# EAGLE design pcb (EAGLE 7.5.0)
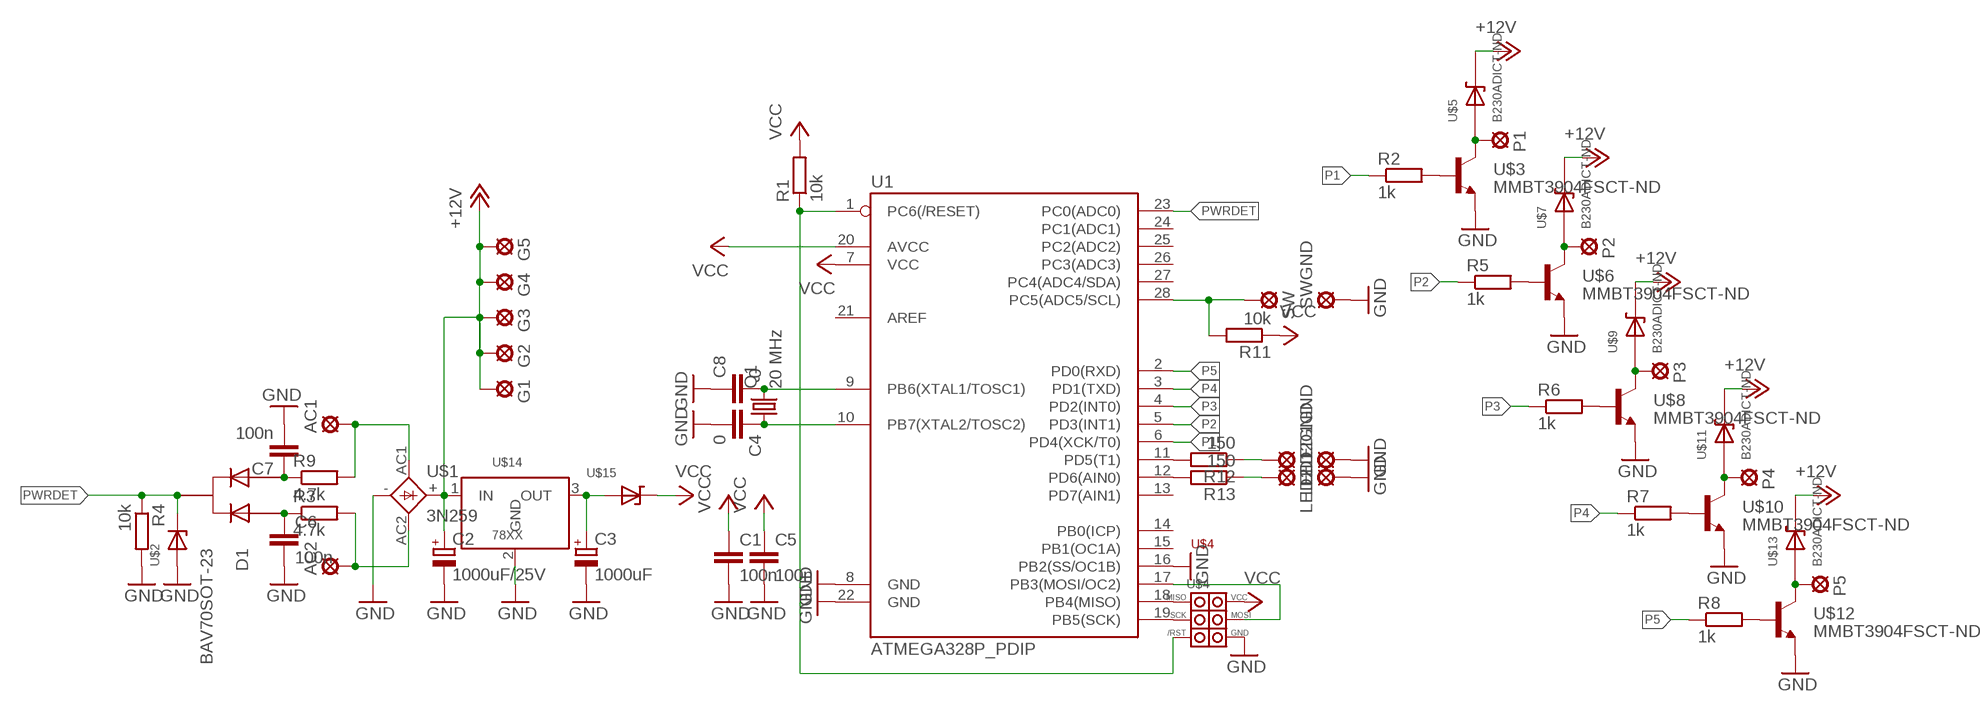
[diagram p0: schematic, sheet 1]

## Parts
AC1  LSP10  [LSP10]
AC2  LSP10  [LSP10]
C1  100n  C-EUC0603  [C0603]
C2  1000uF/25V  CPOL-EUE5-13  [E5-13]
C3  1000uF  CPOL-EUE5-10.5  [E5-10,5]
C4  0  C-EUC0603  [C0603]
C5  100n  C-EUC0603  [C0603]
C6  100n  C-EUC0603  [C0603]
C7  100n  C-EUC0603  [C0603]
C8  0  C-EUC0603  [C0603]
D1  BAV70SOT-23  [SOT23]
G1  LSP10  [LSP10]
G2  LSP10  [LSP10]
G3  LSP10  [LSP10]
G4  LSP10  [LSP10]
G5  LSP10  [LSP10]
LED1  LSP10  [LSP10]
LED1GND  LSP10  [LSP10]
LED2  LSP10  [LSP10]
LED2GND  LSP10  [LSP10]
P1  LSP10  [LSP10]
P2  LSP10  [LSP10]
P3  LSP10  [LSP10]
P4  LSP10  [LSP10]
P5  LSP10  [LSP10]
Q1  20 MHz  CRYSTALCTS406CTS406  [CTS406]
R1  10k  R-EU_R0603  [R0603]
R2  1k  R-EU_R0603  [R0603]
R3  4.7k  R-EU_R0603  [R0603]
R4  10k  R-EU_R0603  [R0603]
R5  1k  R-EU_R0603  [R0603]
R6  1k  R-EU_R0603  [R0603]
R7  1k  R-EU_R0603  [R0603]
R8  1k  R-EU_R0603  [R0603]
R9  4.7k  R-EU_R0603  [R0603]
R11  10k  R-EU_R0603  [R0603]
R12  150  R-EU_R0603  [R0603]
R13  150  R-EU_R0603  [R0603]
SW  LSP10  [LSP10]
SWGND  LSP10  [LSP10]
U1  ATMEGA328P_PDIP  [DIL28-3]
U$1  3N259  [KBPM]
U$2  MA8051CT  [SOD323-W]
U$3  MMBT3904FSCT-ND  [SOT-23]
U$4  ISP-HEADER-6  [ISPHEADER-6]
U$5  B230ADICT-ND  [SMA/SMB]
U$6  MMBT3904FSCT-ND  [SOT-23]
U$7  B230ADICT-ND  [SMA/SMB]
U$8  MMBT3904FSCT-ND  [SOT-23]
U$9  B230ADICT-ND  [SMA/SMB]
U$10  MMBT3904FSCT-ND  [SOT-23]
U$11  B230ADICT-ND  [SMA/SMB]
U$12  MMBT3904FSCT-ND  [SOT-23]
U$13  B230ADICT-ND  [SMA/SMB]
U$14  78XX  [DPAK]
U$15  MBRM140T1  [CASE457]

## Nets
+12V: C2.+ G1.MP G2.MP G3.MP G4.MP G5.MP U$1.+ U$5.1(CAT) U$7.1(CAT) U$9.1(CAT) U$11.1(CAT) U$13.1(CAT) U$14.1(IN)
/RST: R1.1 U1.1(PC6(/RESET)) U$4./RST
AC1: AC1.MP R9.2 U$1.AC1
AC2: AC2.MP R3.2 U$1.AC2
LED1: LED1.MP R12.1
LED2: LED2.MP R13.1
MISO: U1.18(PB4(MISO)) U$4.MISO
MOSI: U1.17(PB3(MOSI/OC2)) U$4.MOSI
N$1: C8.2 Q1.3 U1.9(PB6(XTAL1/TOSC1))
N$2: C6.1 D1.1ANODE(ANODE1) R3.1
N$3: C4.1 Q1.1 U1.10(PB7(XTAL2/TOSC2))
N$4: C3.+ U$14.3(OUT) U$15.2(AN)
N$5: P3.MP U$8.3(C) U$9.2(AN)
N$6: P2.MP U$6.3(C) U$7.2(AN)
N$7: R5.2 U$6.1(B)
N$8: C7.1 D1.2ANODE(ANODE2) R9.1
N$9: P5.MP U$12.3(C) U$13.2(AN)
N$17: R11.2 SW.MP U1.28(PC5(ADC5/SCL))
N$18: R12.2 U1.11(PD5(T1))
N$19: R2.2 U$3.1(B)
N$20: P1.MP U$3.3(C) U$5.2(AN)
N$21: P4.MP U$10.3(C) U$11.2(AN)
N$22: R6.2 U$8.1(B)
N$23: R13.2 U1.12(PD6(AIN0))
N$24: R7.2 U$10.1(B)
N$25: R8.2 U$12.1(B)
N$34: C1.2 C2.- C3.- C4.2 C5.2 C6.2 C7.2 C8.1 LED1GND.MP LED2GND.MP R4.2 SWGND.MP U1.8(GND) U1.16(PB2(SS/OC1B)) U1.22(GND) U$1.- U$2.A(AN) U$3.2(E) U$4.GND U$6.2(E) U$8.2(E) U$10.2(E) U$12.2(E) U$14.2(GND) ; supply symbol labelled GND
P1: R2.1 U1.6(PD4(XCK/T0))
P2: R5.1 U1.5(PD3(INT1))
P3: R6.1 U1.4(PD2(INT0))
P4: R7.1 U1.3(PD1(TXD))
P5: R8.1 U1.2(PD0(RXD))
PWRDET: D1.3CATODE(CATODE) R4.1 U1.23(PC0(ADC0)) U$2.C(CAT)
SCK: U1.19(PB5(SCK)) U$4.SCK
VCC: C1.1 C5.1 R1.2 R11.1 U1.7(VCC) U1.20(AVCC) U$4.VCC U$15.1(CAT)
Unconnected: U1.13(PD7(AIN1)) U1.14(PB0(ICP)) U1.15(PB1(OC1A)) U1.21(AREF) U1.24(PC1(ADC1)) U1.25(PC2(ADC2)) U1.26(PC3(ADC3)) U1.27(PC4(ADC4/SDA))

## Library data of the parts
AC1 AC2 G1-G5 LED1 LED1GND LED2 LED2GND P1-P5 SW SWGND = solpad:LSP10: SOLDER PAD drill 1.0 mm, distributor Buerklin, 12H555
C1 C4-C8 = rcl:C-EU: CAPACITOR, European symbol
C2 C3 = mrrcomps:CPOL-EU: POLARIZED CAPACITOR, European symbol
D1 = BAV70:BAV70: Small Signal Diode BAV70
Q1 = mrrcomps:CRYSTALCTS406: CRYSTAL
R1-R9 R11-R13 = rcl:R-EU_: RESISTOR, European symbol
U1 = mrrcomps:ATMEGA328P_PDIP: uC used in the Arduino 32kb flash, 1k EEPROM, 2k SRAM This is the through-hole version of this chip.
U$1 = BAV70:3N259
U$2 = mrrcomps:MA8051CT
U$3 U$6 U$8 U$10 U$12 = GuShH:MMBT3904
U$4 = Lars-Wafer-Connectors:ISP-HEADER-6
U$5 U$7 U$9 U$11 U$13 = mrrcomps:B230ADICT-ND
U$14 = car:78XX
U$15 = mrrcomps:MBRM140T1: SMT Schottky Power Rectifier

## Board
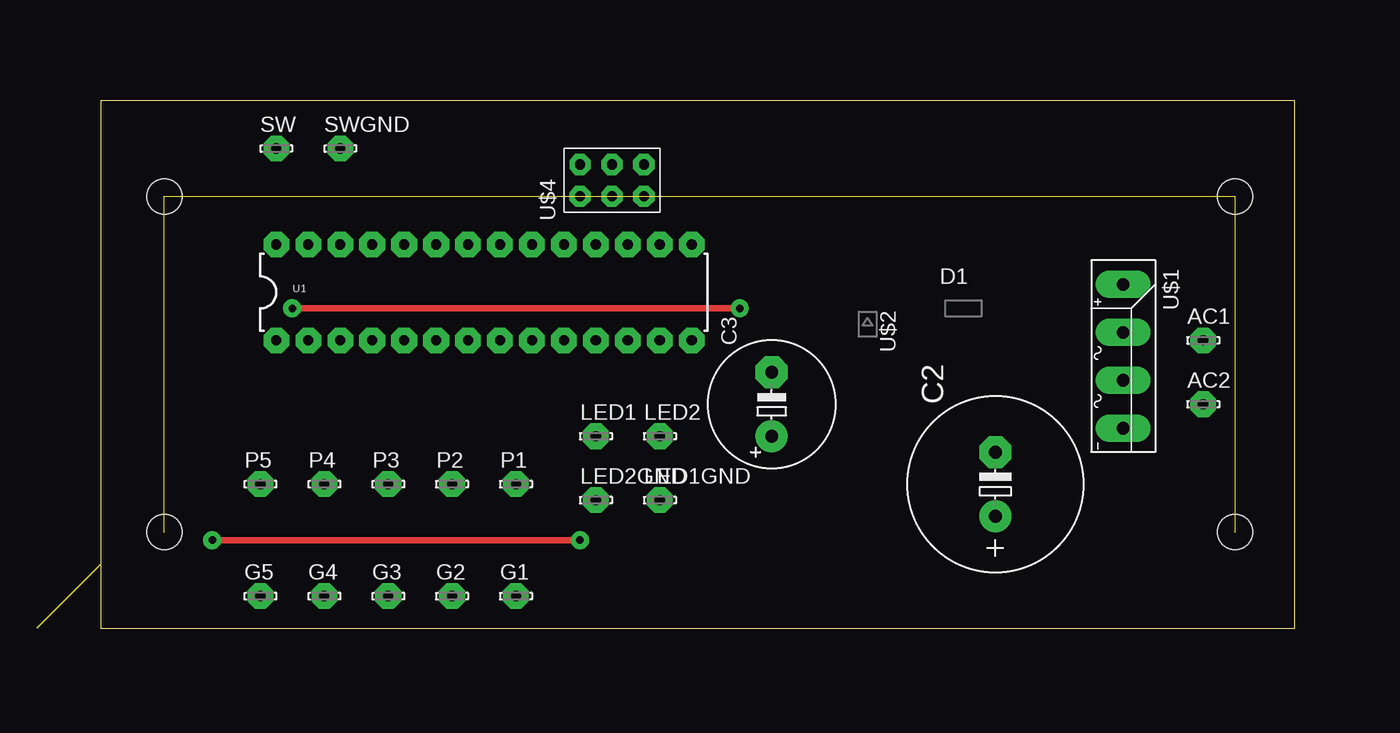
[diagram p1: board, top side]
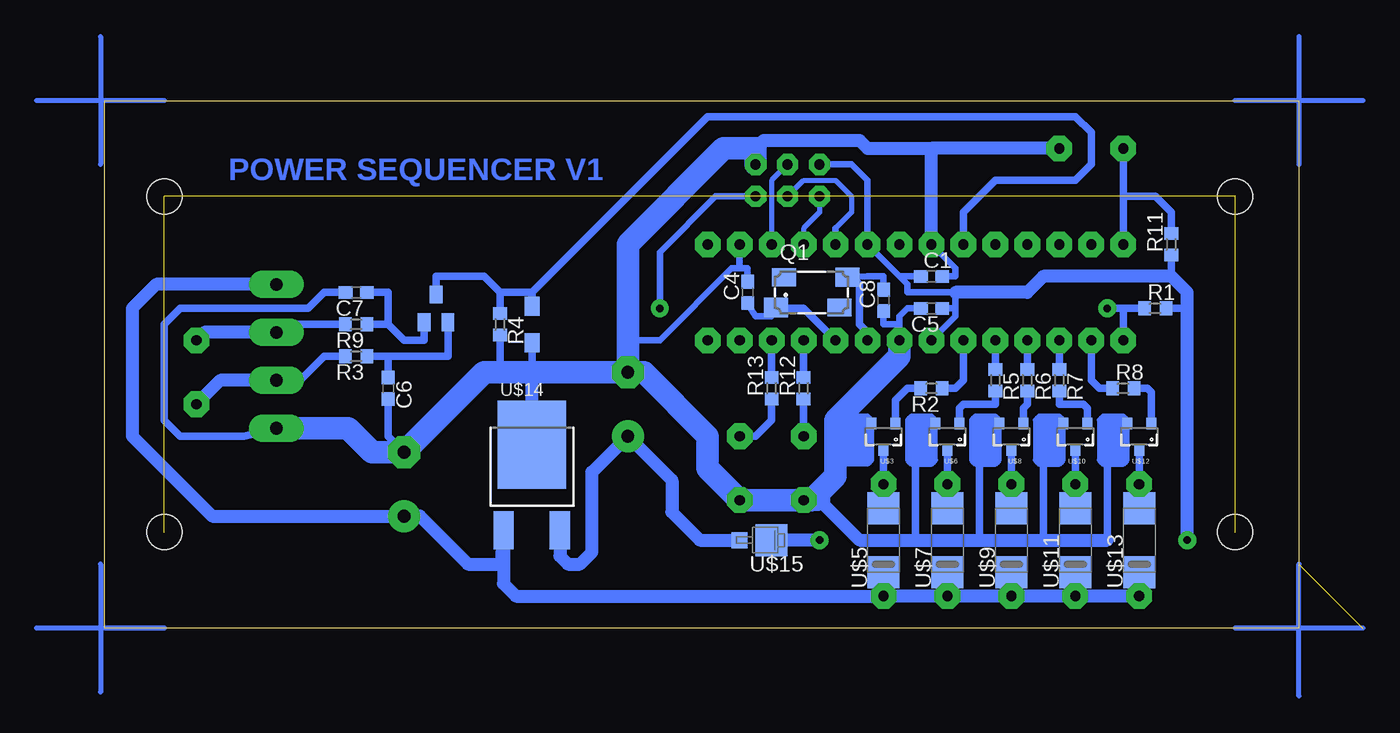
[diagram p2: board, bottom side, seen from below]

Size 94.92 x 41.9 mm. Coordinates in mm from the lower left corner, seen from the top.
Outline: 94.92,0 94.92,41.9 0,41.9 0,0 94.92,0
Copper layers (1*16): Top 0.035mm / dielectric 1.5mm / Bottom 0.035mm
Design rules "default": minimum track width 10mil, minimum drill 24mil, track to track 8mil, track to pad 8mil, pad to pad 8mil, via to via 8mil, smd to smd 8mil, copper to edge 40mil, drill to drill 8mil, minimum pad ring 10mil, minimum via ring 8mil, stop-mask expansion 4mil, vias tented up to drill 0mil, thermal gap 10mil
Holes 2.8 mm at 90.17,34.29 90.17,7.62 5.08,34.29 5.08,7.62

### Footprints (pad centres in the part's own frame; a part is rotated, then mirrored left to right if it is on the bottom)
LSP10 = drill 0.813 pad 2.032 octagon: MP 0,0
C0603 = smd 1.1 x 1: 1 -0.85,0; 2 0.85,0
E5-13 = drill 1.016 pad 2.54: + -2.54,0 | drill 1.016 pad 2.54 octagon: - 2.54,0
E5-10,5 = drill 1.016 pad 2.54: + -2.54,0 | drill 1.016 pad 2.54 octagon: - 2.54,0
SOT23 = smd 1 x 1.4 bottom: 1ANODE -0.95,-1.1; 2ANODE 0.95,-1.1; 3CATODE 0,1.1
CTS406 = smd 1.9 x 1.524: 1 -2.835,-1.2; 3 2.835,1.2 | smd 1.9 x 1.4: 2 2.2,-1.2; 4 -2.2,1.2
R0603 = smd 1 x 1.1: 1 -0.85,0; 2 0.85,0
DIL28-3 = drill 0.813 pad 2.032 octagon: 1 -16.51,-3.81; 2 -13.97,-3.81; 3 -11.43,-3.81; 4 -8.89,-3.81; 5 -6.35,-3.81; 6 -3.81,-3.81; 7 -1.27,-3.81; 8 1.27,-3.81; 9 3.81,-3.81; 10 6.35,-3.81; 11 8.89,-3.81; 12 11.43,-3.81; 13 13.97,-3.81; 14 16.51,-3.81; 15 16.51,3.81; 16 13.97,3.81; 17 11.43,3.81; 18 8.89,3.81; 19 6.35,3.81; 20 3.81,3.81; 21 1.27,3.81; 22 -1.27,3.81; 23 -3.81,3.81; 24 -6.35,3.81; 25 -8.89,3.81; 26 -11.43,3.81; 27 -13.97,3.81; 28 -16.51,3.81
KBPM = drill 1 pad 2.184 long: + -5.715,0; - 5.715,0; AC1 -1.905,0; AC2 1.905,0
SOD323-W = smd 1.5 x 1.2 bottom: A 1.45,0; C -1.45,0
SOT-23 = smd 0.8 x 0.9: 1 -0.95,-1; 2 0.95,-1; 3 0,1.1
ISPHEADER-6 = drill 0.8 pad 1.676 octagon: /RST -1.27,-2.54; GND 1.27,-2.54; MISO -1.27,2.54; MOSI 1.27,0; SCK -1.27,0; VCC 1.27,2.54
SMA/SMB = smd 2.54 x 2.54: 1 -2.54,0; 2 2.54,0
DPAK = smd 1.6 x 2.997: 1 -2.261,-4.928; 3 2.21,-4.928 | smd 5.452 x 7: 2 0,1.853
CASE457 = smd 2.54 x 2.54: 1 -1.27,0 | smd 1.27 x 1.27: 2 1.27,0

### Placement (x,y rotation side)
AC1  87.63,22.86 0 top
AC2  87.63,17.78 0 top
C1  29.21,27.94 0 bottom
C2  71.12,11.43 90 top
C3  53.34,17.78 90 top
C4  43.81,26.67 90 bottom
C5  29.21,25.4 180 bottom
C6  72.39,19.05 270 bottom
C7  74.93,26.67 180 bottom
C8  33.02,26.04 90 bottom
D1  68.58,25.4 0 top
G1  33.02,2.54 0 top
G2  27.94,2.54 0 top
G3  22.86,2.54 0 top
G4  17.78,2.54 0 top
G5  12.7,2.54 0 top
LED1  39.37,15.24 0 top
LED1GND  44.45,10.16 0 top
LED2  44.45,15.24 0 top
LED2GND  39.37,10.16 0 top
P1  33.02,11.43 0 top
P2  27.94,11.43 0 top
P3  22.86,11.43 0 top
P4  17.78,11.43 0 top
P5  12.7,11.43 0 top
Q1  38.73,26.67 0 bottom
R1  11.43,25.4 0 bottom
R2  29.21,19.05 180 bottom
R3  74.93,21.59 180 bottom
R4  63.5,24.13 270 bottom
R5  24.13,19.68 270 bottom
R6  21.59,19.68 270 bottom
R7  19.05,19.68 270 bottom
R8  13.97,19.05 0 bottom
R9  74.93,24.13 180 bottom
R11  10.16,30.48 90 bottom
R12  39.37,19.05 90 bottom
R13  41.91,19.05 90 bottom
SW  13.97,38.1 0 top
SWGND  19.05,38.1 0 top
U1  30.48,26.67 0 top
U$1  81.28,21.59 270 top
U$2  60.96,24.13 270 top
U$3  33.02,15.24 180 bottom
U$4  40.64,35.56 90 top
U$5  33.02,6.99 90 bottom
U$6  27.94,15.24 180 bottom
U$7  27.94,6.99 90 bottom
U$8  22.86,15.24 180 bottom
U$9  22.86,6.99 90 bottom
U$10  17.78,15.24 180 bottom
U$11  17.78,6.99 90 bottom
U$12  12.7,15.24 180 bottom
U$13  12.7,6.99 90 bottom
U$14  60.96,12.7 0 bottom
U$15  43.18,6.99 180 bottom

### Tracks (layer width: path | path; a pad name or v marks a point on that pad's centre or on a via)
+12V
  Bottom 0.61: U$13.1 G5.MP | U$11.1 G4.MP | U$9.1 G3.MP | U$7.1 G2.MP | U$5.1 G1.MP
  Bottom 1.016: U$1.+ 90.81,27.3 92.71,25.4 92.71,15.24 86.36,8.89 C2.+ 69.85,8.89 66.04,5.08 63.37,5.08 U$14.1 63.22,3.53 62.23,2.54 G1.MP G2.MP G3.MP G4.MP G5.MP
/RST  (via drill 0.6 pad 1.42)
  Top 0.508: v15.24,25.4 v50.8,25.4
  Bottom 0.508: v50.8,25.4 50.8,29.84 46.35,34.29 U$4./RST
  Bottom 0.61: R1.1 v15.24,25.4 13.97,25.4 U1.1
AC1
  Bottom 0.61: 87,23.5 AC1.MP | U$1.AC1 80.64,24.13 R9.2
  Bottom 1.016: U$1.AC1 87,23.5
AC2
  Bottom 0.61: R3.2 77.47,21.59 80.01,19.05 80.64,19.68 U$1.AC2
  Bottom 1.016: U$1.AC2 85.72,19.68 AC2.MP
LED1
  Bottom 0.61: R12.1 LED1.MP
LED2
  Bottom 0.61: R13.1 41.91,16.51 43.18,15.24 LED2.MP
MISO
  Bottom 0.406: U$4.MISO 38.1,33.02 39.37,31.75 U1.18
MOSI
  Bottom 0.406: U$4.MOSI 41.91,35.56 U1.17
N$1
  Bottom 0.508: C8.2 33.02,27.94 34.29,27.94 Q1.3
  Bottom 0.61: Q1.3 35.27,27.64 34.92,27.3 34.92,24.13 34.29,23.5 U1.9
N$2
  Bottom 0.61: R3.1 72.39,21.59 | 72.39,21.59 67.63,21.59 D1.1ANODE | C6.1 72.39,21.59
N$3
  Bottom 0.508: C4.1 43.18,24.77 41.91,24.77 Q1.1
  Bottom 0.61: U1.10 39.37,25.4 40.87,25.4 Q1.1
N$4
  Bottom 1.016: U$14.3 58.74,7.77 58.74,5.71 58.1,5.08 57.15,5.08 56.2,6.03 56.2,12.38 C3.+ 49.85,11.75 49.85,9.21 47.62,6.99 U$15.2
N$5
  Bottom 0.61: U$9.2 P3.MP U$8.3
N$6
  Bottom 0.61: U$7.2 P2.MP 27.94,12.7 27.94,13.65 U$6.3
N$7
  Bottom 0.61: R5.2 24.13,17.78 26.67,17.78 26.99,17.46 U$6.1
N$8
  Bottom 0.61: R9.1 72.39,24.13 | 72.39,24.13 71.12,22.86 69.53,22.86 D1.2ANODE | C7.1 72.39,26.67 72.39,24.13
N$9
  Bottom 0.61: U$13.2 P5.MP U$12.3
N$10
  Bottom 0.406: 19.05,16.83 20.64,16.83 20.95,16.51 20.95,13.34 20.64,13.02 19.05,13.02 18.73,13.34 18.73,16.51 19.05,16.83
N$11
  Bottom 0.406: 13.65,16.51 13.97,16.83 15.56,16.83 15.88,16.51 15.88,13.34 15.56,13.02 13.97,13.02 13.65,13.34 13.65,16.51
N$12
  Bottom 0.406: 23.81,16.51 24.13,16.83 25.72,16.83 26.04,16.51 26.04,13.34 25.72,13.02 24.13,13.02 23.81,13.34 23.81,16.51
N$13
  Bottom 0.406: 28.89,16.51 29.21,16.83 30.8,16.83 31.11,16.51 31.11,13.34 30.8,13.02 29.21,13.02 28.89,13.34 28.89,16.51
N$15  (via drill 0.6)  (3 unrouted)
  other vias: 5.08,7.62 5.08,34.29 90.17,7.62 90.17,34.29
N$17
  Bottom 0.61: U1.28 13.97,34.29 | 13.97,34.29 SW.MP | R11.2 10.16,33.02 11.43,34.29 13.97,34.29
N$18
  Bottom 0.61: U1.11 R12.2
N$19
  Bottom 0.61: R2.2 31.11,19.05 32.07,18.09 U$3.1
N$20
  Bottom 0.61: U$5.2 P1.MP U$3.3
N$21
  Bottom 0.61: U$11.2 P4.MP U$10.3
N$22
  Bottom 0.61: U$8.1 21.91,17.46 21.59,17.78 R6.2
N$23
  Bottom 0.61: U1.12 R13.2
N$24
  Bottom 0.61: R7.2 19.05,17.78 17.14,17.78 16.83,17.46 U$10.1
N$25
  Bottom 0.61: U$12.1 11.75,18.73 12.06,19.05 R8.2
N$26  (1 unrouted)
  Bottom 0.406: -5.08,0 5.08,0 | 0,-5.4 0,5.08
N$27
  Bottom 0.406: -5.08,41.91 5.08,41.91
N$28
  Bottom 0.406: 0,46.99 0,36.83
N$29
  Bottom 0.406: 90.17,0 100.33,0
N$30
  Bottom 0.406: 95.25,5.08 95.25,-5.08
N$31
  Bottom 0.406: 90.17,41.91 100.33,41.91
N$32
  Bottom 0.406: 95.25,46.99 95.25,36.83
N$33
  Bottom 0.406: 33.97,16.51 34.29,16.83 35.88,16.83
N$34
  Bottom 0.406: 33.97,15.88 33.97,13.34 34.29,13.02 36.83,13.02 | 31.75,24.13 U1.8
  Bottom 0.508: U1.22 27.3,28.57 27.3,27.94 C1.2 | C5.2 31.11,25.4 31.75,24.77 U1.8 | 44.45,28.57 45.09,28.57 50.8,22.86 53.34,22.86 | C8.1 33.02,24.13 31.75,24.13 | C4.2 43.81,28.57 44.45,28.57 | 44.45,28.57 U1.16
  Bottom 0.61: U$2.A 60.96,20.32 | R4.2 63.5,20.32 64.77,20.32 | C6.2 72.39,15.24 C2.- | C7.2 77.47,26.67 78.74,25.4 88.9,25.4 90.17,24.13 90.17,16.51 88.9,15.24 83.82,15.24 U$1.- | U$12.2 14.88,16.24 15.24,15.88 15.24,6.99 | U$10.2 19.95,16.24 20.32,15.88 20.32,6.99 | U$8.2 25.04,16.24 25.4,15.88 25.4,6.99 | U$6.2 30.11,16.24 30.48,15.88 30.48,6.99 | U$3.2 36.47,16.24 36.83,15.88
  Bottom 1.016: 43.18,38.1 42.55,38.73 34.92,38.73 34.29,38.1 29.21,38.1 | U1.22 29.21,38.1 | SWGND.MP 29.21,38.1 | U$14.2 60.96,20.32 | 38.1,10.16 34.92,6.99 30.48,6.99 25.4,6.99 20.32,6.99 15.24,6.99
  Bottom 1.676: LED2GND.MP 38.1,10.16
  Bottom 1.778: U$1.- 75.56,15.88 73.66,13.97 C2.- 64.77,20.32 60.96,20.32 C3.- | C3.- 53.34,22.86 53.34,30.48 45.72,38.1 43.18,38.1 U$4.GND | U1.8 31.75,21.59 36.83,16.51 36.83,15.88 36.83,13.02 36.83,12.06 38.73,10.16 LED2GND.MP LED1GND.MP 46.99,12.7 46.99,15.24 52.07,20.32 C3.-
P1
  Bottom 0.61: R2.1 27.3,19.05 26.67,19.68 U1.6
P2
  Bottom 0.61: U1.5 R5.1
P3
  Bottom 0.61: R6.1 U1.4
P4
  Bottom 0.61: R7.1 U1.3
P5
  Bottom 0.61: R8.1 15.88,19.05 16.51,19.68 U1.2
PWRDET
  Bottom 0.61: U1.23 26.67,33.02 24.13,35.56 17.78,35.56 16.51,36.83 16.51,39.37 17.78,40.64 46.99,40.64 60.96,26.67 | R4.1 63.5,26.67 | U$2.C 60.96,26.67 | 63.5,26.67 60.96,26.67 | D1.3CATODE 68.58,27.94 64.77,27.94 63.5,26.67
SCK
  Bottom 0.406: U$4.SCK 39.37,35.56 36.83,35.56 35.56,34.29 35.56,33.02 36.83,31.75
  Bottom 0.508: 36.83,31.75 U1.19
VCC  (via drill 0.6 pad 1.42)
  Top 0.508: v38.1,6.99 v8.89,6.99
  Bottom 0.508: 31.75,27.94 31.11,27.3 31.11,26.67 27.3,26.67 27.3,25.4 | 31.75,27.94 U1.20 34.29,35.56 35.56,36.83 U$4.VCC | C1.1 31.75,27.94 | 27.3,25.4 27.3,24.77 U1.7 | C5.1 27.3,25.4
  Bottom 0.61: R1.2 8.89,25.4 8.89,26.67 | R11.1 10.16,27.94
  Bottom 1.016: 27.3,26.67 21.59,26.67 20.32,27.94 10.16,27.94 8.89,26.67 v8.89,6.99 | v38.1,6.99 U$15.1
(copper drawn outside any net)
  shapes: Bottom area x5

### Text on the board
Bottom: POWER SEQUENCER V1